# EAGLE design Baby Boomer! (EAGLE 5.11)
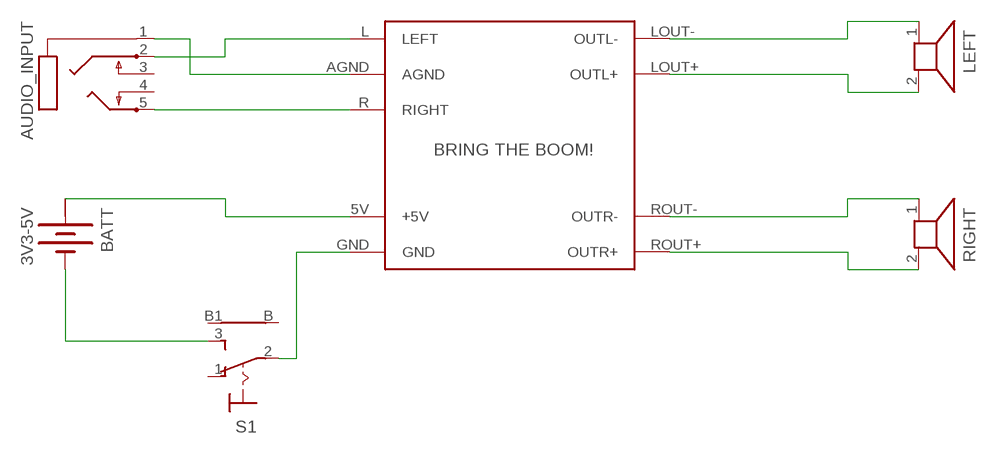
[diagram p0: schematic, sheet 1]

## Parts
AUDIO_INPUT  PG203J  [PG203J]
BATT  3V3-5V  BATTERY  [BATTERY]
LEFT  AL201P  [AL201P]
RIGHT  AL201P  [AL201P]
S1  9070-1W  [9070-1W]
U$1  BABYBOOMER  [BABYBOOMERMODULE]

## Nets
N$1: AUDIO_INPUT.1 U$1.AGND
N$2: AUDIO_INPUT.2 U$1.L(LEFT)
N$3: AUDIO_INPUT.5 U$1.R(RIGHT)
N$4: BATT.+ U$1.5V(+5V)
N$5: BATT.- S1.3(S)
N$6: LEFT.1 U$1.LOUT-(OUTL-)
N$7: LEFT.2 U$1.LOUT+(OUTL+)
N$8: RIGHT.1 U$1.ROUT-(OUTR-)
N$9: RIGHT.2 U$1.ROUT+(OUTR+)
N$10: S1.2(P) U$1.GND
Unconnected: AUDIO_INPUT.3 AUDIO_INPUT.4 S1.1(O) S1.B S1.B1

## Power pins joined to a net without a drawn wire
+: BATT.+@1(+)

## Library data of the parts
AUDIO_INPUT = con-hirschmann:PG203J: MIC/HEADPHONE JACK KS-S stereo microphone/headphone jack PG203JN (Schukat); OC_FARNELL: unknown; OC_NEWARK: unknown
BATT = special:BATTERY: BATTERY
LEFT RIGHT = buzzer:AL201P: SPEAKER Source: Buerklin; OC_FARNELL: unknown; OC_NEWARK: unknown
S1 = switch:9070-1W: TOGGLE SWITCH Marquardt
U$1 = Backoffice Library:BABYBOOMER

## Board
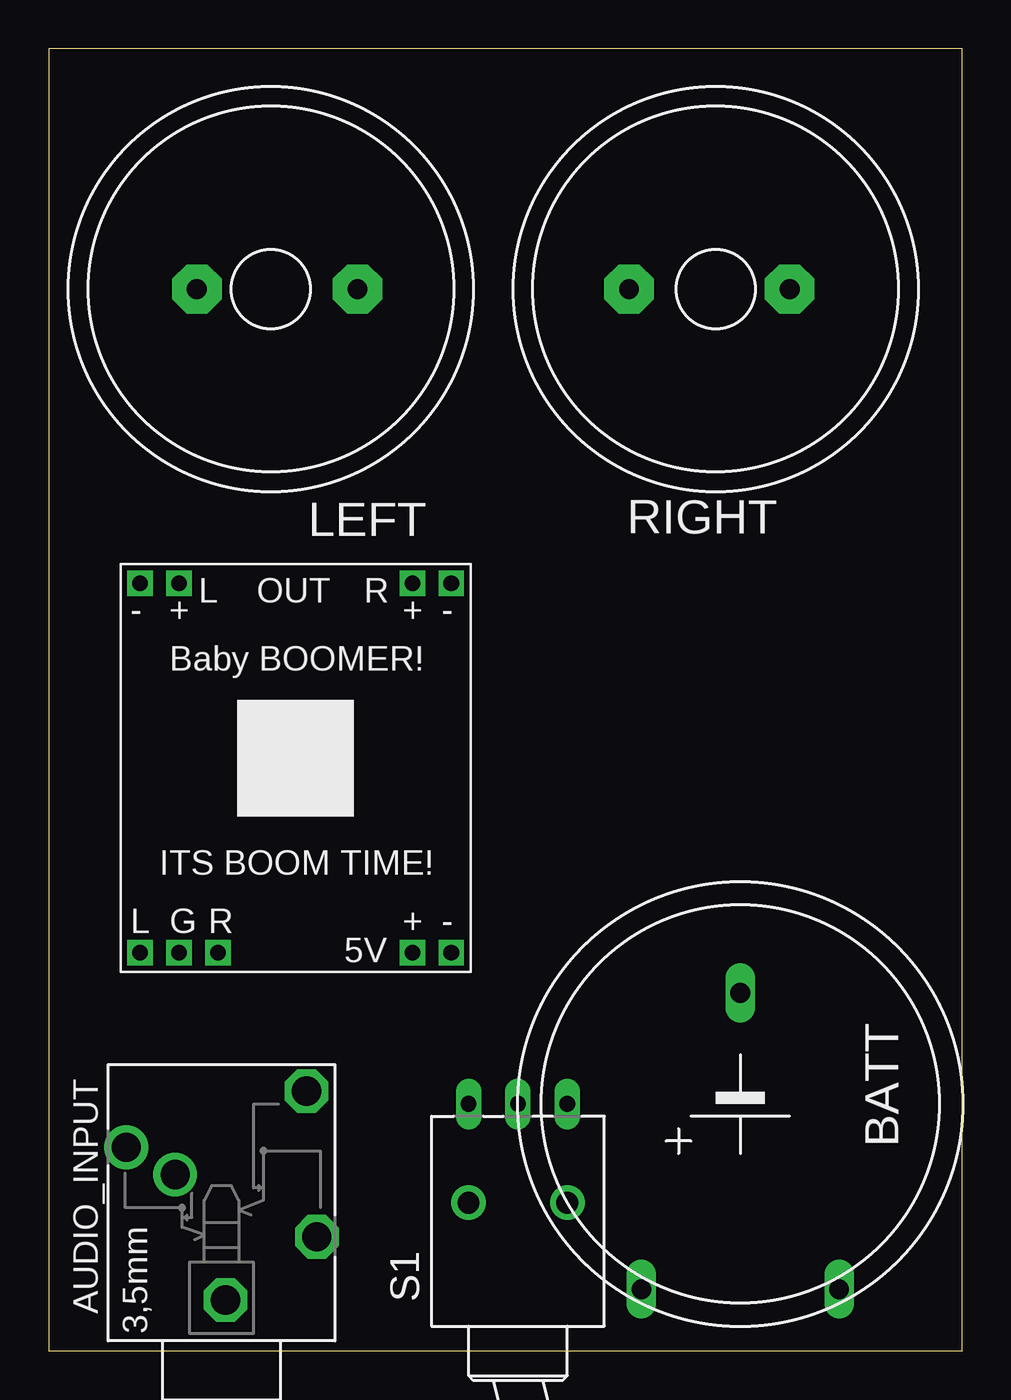
[diagram p1: board, top side]
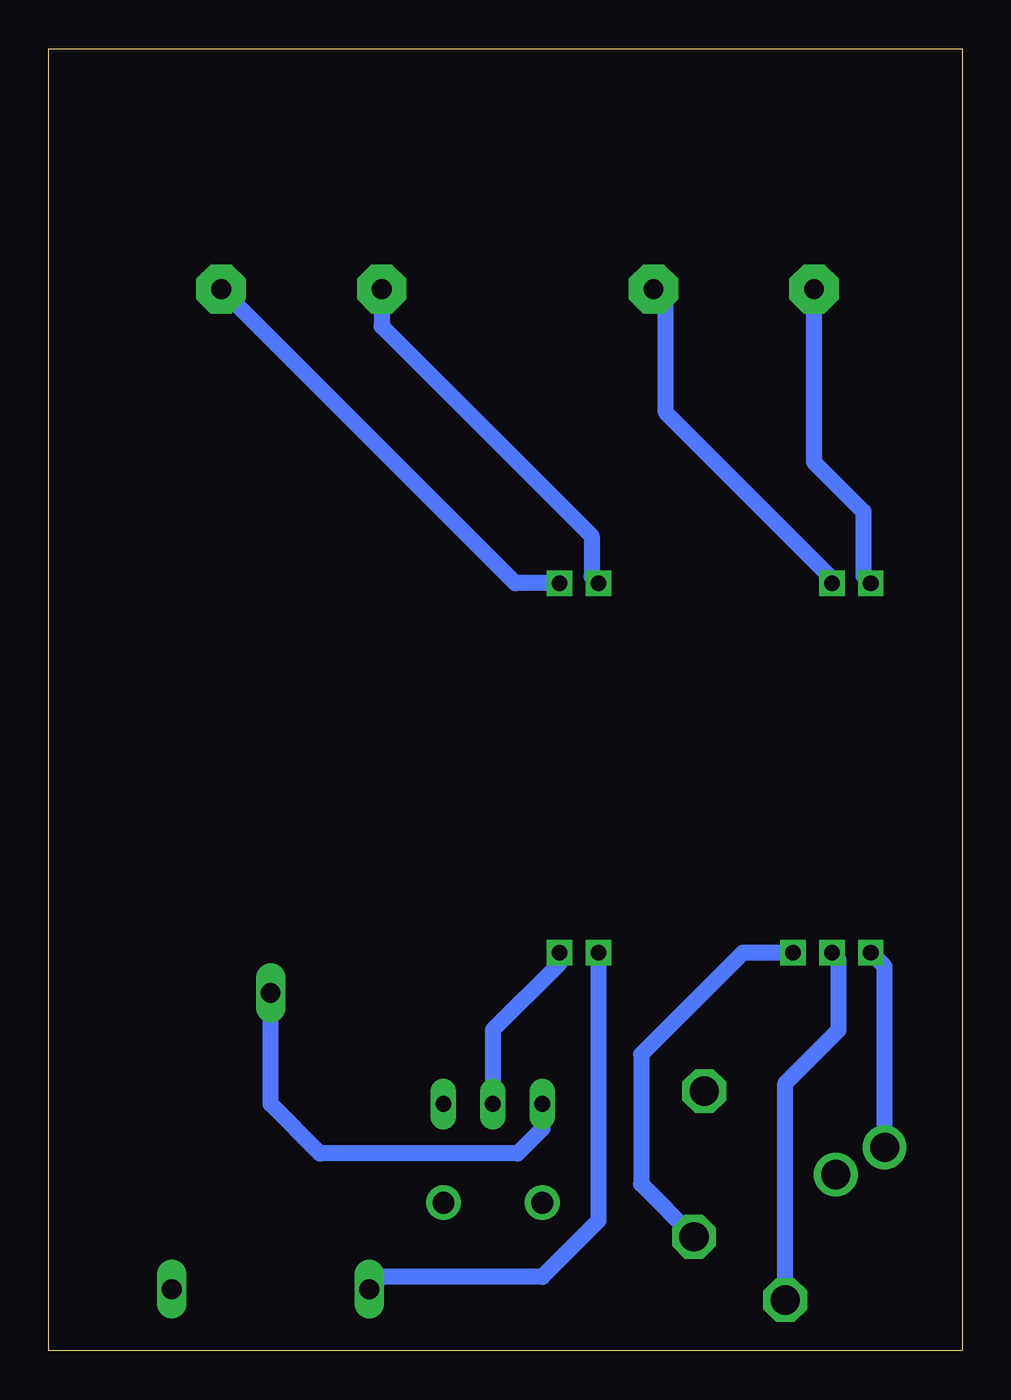
[diagram p2: board, bottom side, seen from below]

Size 46.97 x 66.98 mm. Coordinates in mm from the lower left corner, seen from the top.
Outline: 0,0 46.97,0 46.97,66.98 0,66.98 0,0
Copper layers (1*16): Top 0.035mm / dielectric 1.5mm / Bottom 0.035mm
Design rules "default": minimum track width 10mil, minimum drill 24mil, track to track 8mil, track to pad 8mil, pad to pad 8mil, via to via 8mil, smd to smd 8mil, copper to edge 40mil, drill to drill 8mil, minimum pad ring 10mil, minimum via ring 8mil, stop-mask expansion 4mil, vias tented up to drill 0mil, thermal gap 10mil

### Footprints (pad centres in the part's own frame; a part is rotated, then mirrored left to right if it is on the bottom)
PG203J = drill 1.499 octagon: 1 -5.004,-0.203; 4 5.74,-4.369; 5 -1.753,-4.902 | drill 1.499 round: 2 2.845,4.902; 3 1.448,2.388
BATTERY = drill 1.016 long: + 9.525,-5.08; +@1 9.525,5.08; - -5.715,0
AL201P = drill 1.016 pad 2.54 octagon: 1 -3.81,0; 2 4.445,0
9070-1W = drill 0.813 long: 1 5.08,-2.54; 2 5.08,0; 3 5.08,2.54 | drill 1.118 pad 1.778 round: B 0,-2.54; B1 0,2.54
BABYBOOMERMODULE = drill 0.8 square: 5V 6,-10; AGND -6,-10; GND 8,-10; L -8,-10; LOUT+ -6,9; LOUT- -8,9; R -4,-10; ROUT+ 6,9; ROUT- 8,9

### Placement (x,y rotation side)
AUDIO_INPUT  8.89,7.62 90 top
BATT  35.56,12.7 270 top
LEFT  11.43,54.61 0 top
RIGHT  34.29,54.61 180 top
S1  24.13,7.62 90 top
U$1  12.7,30.48 0 top

### Tracks (layer width: path | path; a pad name or v marks a point on that pad's centre or on a via)
N$1
  Bottom 0.813: AUDIO_INPUT.1 9.09,13.77 6.35,16.51 6.35,20.13 U$1.AGND
N$2
  Bottom 0.813: AUDIO_INPUT.2 3.99,19.77 U$1.L
N$3
  Bottom 0.813: U$1.R 11.27,20.48 16.51,15.24 16.51,8.59 AUDIO_INPUT.5
N$4
  Bottom 0.813: U$1.5V 18.7,6.7 21.59,3.81 29.84,3.81 BATT.+
N$5
  Bottom 0.813: S1.3 21.59,11.43 22.86,10.16 33.02,10.16 35.56,12.7 BATT.-
N$6
  Bottom 0.813: LEFT.1 7.62,45.72 5.08,43.18 5.08,39.86 U$1.LOUT-
N$7
  Bottom 0.813: U$1.LOUT+ 6.7,39.72 15.24,48.26 15.24,53.98 LEFT.2
N$8
  Bottom 0.813: U$1.ROUT- 22.97,39.48 RIGHT.1
N$9
  Bottom 0.813: RIGHT.2 29.84,52.7 19.05,41.91 19.05,39.83 U$1.ROUT+
N$10
  Bottom 0.813: U$1.GND 20.7,19.94 24.13,16.51 S1.2